# Altium schematic sheet Block diagram.SchDoc
size 292 x 193 mm; Organization: ORGANIZATION; Address1: ADDRESS 1; Address2: ADDRESS 2; Address3: ADDRESS 3; Address4: ADDRESS 4; Revision: 0.3; SheetNumber: 1; SheetTotal: 3; Project: Maypole; ENG_APP_DATE: --/--/--; DSN_APP_DATE: --/--/--; CHK_APP_DATE: --/--/--; VERSION: 1
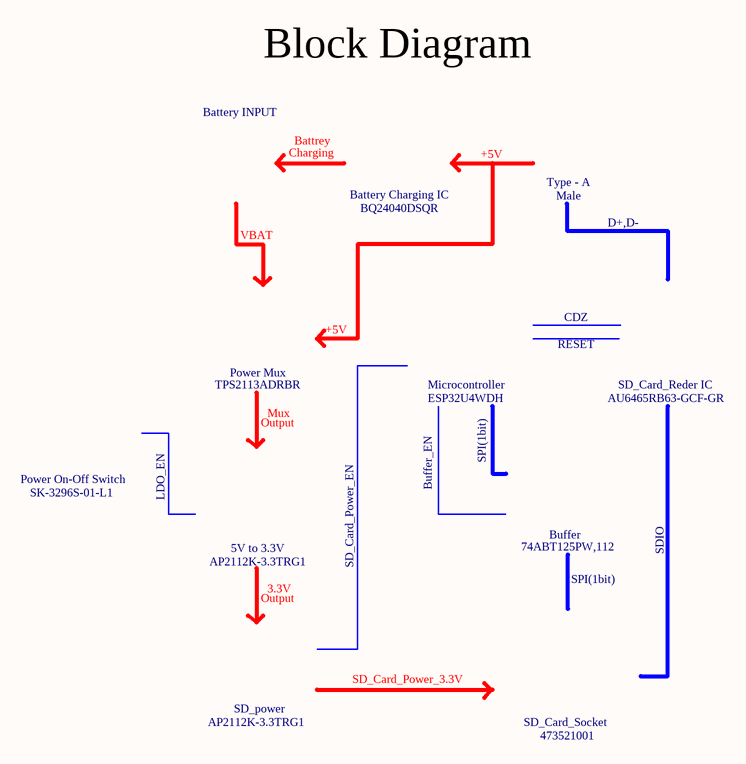
[diagram p0: Block diagram.SchDoc]

## Notes on the sheet
- Block Diagram
- Battery INPUT
- Charging
- Battrey
- Battery Charging IC
- +5V
- Type - A
- Male
- VBAT
- BQ24040DSQR
- D+,D-
- CDZ
- TPS2113ADRBR
- Power Mux
- Microcontroller
- ESP32U4WDH
- RESET
- AU6465RB63-GCF-GR
- SD_Card_Reder IC
- Output
- Mux
- SPI(1bit)
- Power On-Off Switch
- SK-3296S-01-L1
- LDO_EN
- Buffer_EN
- Buffer
- AP2112K-3.3TRG1
- 5V to 3.3V
- 3.3V
- SD_Card_Power_EN
- 74ABT125PW,112
- SDIO
- SD_power
- SD_Card_Power_3.3V
- SD_Card_Socket
- 473521001
- VICHARAK
- TITLE :-
- VERSION :-
- PROJECT :-
- SHEET :-
- OF
- REVISION:-
- DATE :-